# Altium schematic sheet Fuente.SchDoc: Fuente_SCH
size A4; Author: Hojnadel - Salazar Ato; Revision: Rev1.0; SheetNumber: 2; SheetTotal: 6
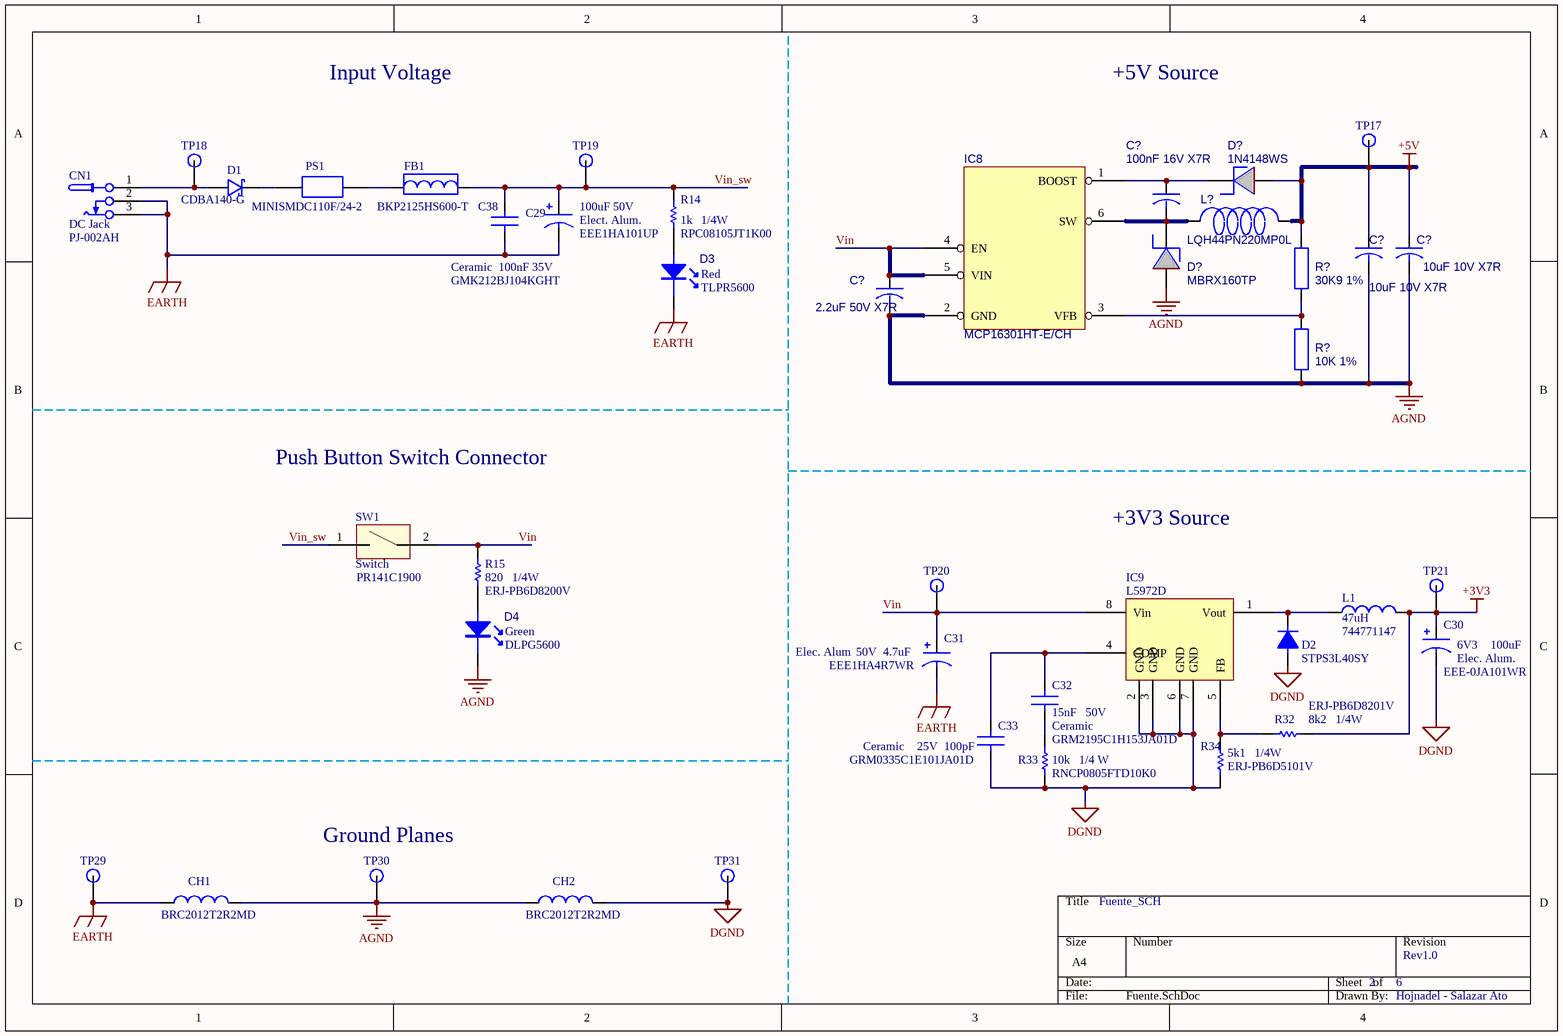
[diagram p0: Fuente.SchDoc]

## Parts
(Parts that share a designator on the sheet are numbered #1, #2 ... from top to bottom, then left to right.)
C29  C: 100uF  V: 50V  Material: Elect. Alum.  Part number: EEE1HA101UP  [C_AE10083X105M]  (hidden comment: 100uF 50V ElecAlum)
C30  C: 100uF  V: 6V3  Material: Elec. Alum.  Part number: EEE-0JA101WR  [C_AE6553X54M]  (hidden comment: 100uF 6V3 ElecAlum)
C31  C: 4.7uF  V: 50V  Material: Elec. Alum  Part number: EEE1HA4R7WR  [C_AE6553X54M]  (hidden comment: 4.7uF 50V ElecAlum)
C32  C: 15nF  V: 50V  Part Number: GRM2195C1H153JA01D  Material: Ceramic  [C_0805]  (hidden comment: 15nF 50V Ceramic)
C33  C: 100pF  V: 25V  Part Number: GRM0335C1E101JA01D  Material: Ceramic  [C_0805]  (hidden comment: 100pF 25V Ceramic)
C38  C: 100nF  V: 35V  Part Number: GMK212BJ104KGHT  Material: Ceramic  [C_0805]  (hidden comment: 100nF 35V Ceramic)
C?#1  100nF 16V X7R  [C_0805]
C?#2  10uF 10V X7R  [C_0805]
C?#3  10uF 10V X7R  [C_0805]
C?#4  2.2uF 50V X7R  [C_0805]
CH1  Part Number: BRC2012T2R2MD  [I_CHOQUE_DFN]  (hidden comment: Choke)
CH2  Part Number: BRC2012T2R2MD  [I_CHOQUE_DFN]  (hidden comment: Choke)
CN1  DC Jack  Part Number: PJ-002AH  [Jack_PJ002A]
D1  CDBA140-G  [D_DO-214AC_Schottky]
D2  Part Number: STPS3L40SY  [D_M6959X25N]  (hidden comment: STPS3L40)
D3  Color: Red  Part Number: TLPR5600  [Led_TH]  (hidden comment: LED)
D4  Part Number: DLPG5600  Color: Green  [Led_TH]  (hidden comment: LED)
D?#1  1N4148WS  [SOD_323]
D?#2  MBRX160TP  [SOD_123]
FB1  Part Number: BKP2125HS600-T  [Ferrite_bead]  (hidden comment: Ferrite Bead)
IC8  MCP16301HT-E/CH  [SOT23_6P]
IC9  L5972D  [SO8]
L1  Part Number: 744771147  [I_P128122X60N]  (hidden comment: 47uH)
L?  LQH44PN220MP0L  [VLCF5028]
PS1  Part Number: MINISMDC110F/24-2  [POLISWITCH_1]  (hidden comment: Polyswitch)
R14  value 1k  Potencia: 1/4W  Part Number: RPC08105JT1K00  [R_0805]  (hidden comment: Res1)
R15  value 820  Potencia: 1/4W  Part Number: ERJ-PB6D8200V  [R_0805]  (hidden comment: Res1)
R32  value 8k2  Part Number: ERJ-PB6D8201V  Power: 1/4W  [R_0805]  (hidden comment: 8k2 1/4W)
R33  value 10k  Part Number: RNCP0805FTD10K0  Power: 1/4 W  [R_0805]  (hidden comment: 10k 1/4W)
R34  value 5k1  Part Number: ERJ-PB6D5101V  Power: 1/4W  [R_0805]  (hidden comment: 5k1 1/4W)
R?#1  30K9 1%  [R_0805]
R?#2  10K 1%  [R_0805]
SW1  Switch  Part Number: PR141C1900  [BORNERA_2X5MM]
TP17  TP  [TP]  (value not drawn)
TP18  TP  [TP]  (value not drawn)
TP19  TP  [TP]  (value not drawn)
TP20  TP  [TP]  (value not drawn)
TP21  TP  [TP]  (value not drawn)
TP29  TP  [TP]  (value not drawn)
TP30  TP  [TP]  (value not drawn)
TP31  TP  [TP]  (value not drawn)

## Nets
+3V3: C30.1 L1.2 R32.1 TP21.1
+5V: C?#2.1 C?#3.1 D?#1.1(A) L?.2 R?#1.2 TP17.1
AGND: C?#2.2 C?#3.2 C?#4.2 CH1.2 CH2.1 D4.2 D?#2.1(A) IC8.2(GND) R?#2.1 TP30.1
DGND: C30.2 C33.2 CH2.2 D2.1 IC9.2(GND) IC9.3(GND) IC9.6(GND) IC9.7(GND) R33.1 R34.1 TP31.1
EARTH: C29.2 C31.2 C38.2 CH1.1 CN1.2 CN1.3 D3.2 TP29.1
Vin: C31.1 C?#4.1 IC8.4(EN) IC8.5(VIN) IC9.8(Vin) R15.2 SW1.2 TP20.1
Vin_sw: C29.1 C38.1 FB1.2 R14.1 SW1.1 TP19.1
NetC32_1: C32.1 C33.1 IC9.4(COMP)
NetC32_2: C32.2 R33.2
NetC?#1_1: C?#1.1 D?#1.2(K) IC8.1(BOOST)
NetC?#1_2: C?#1.2 D?#2.2(K) IC8.6(SW) L?.1
NetCN1_1: CN1.1 D1.1(A) TP18.1
NetD1_2: D1.2(K) PS1.1
NetD2_2: D2.2 IC9.1(Vout) L1.1
NetD3_1: D3.1 R14.2
NetD4_1: D4.1 R15.1
NetFB1_1: FB1.1 PS1.2
NetIC8_3: IC8.3(VFB) R?#1.1 R?#2.2
NetIC9_5: IC9.5(FB) R32.2 R34.2

## Notes on the sheet
- Input Voltage
- +5V Source
- Push Button Switch Connector
- +3V3 Source
- (near TP30) Ground Planes

## Library data of the parts
C29-C31 = Cap_Elec: Capacitor
C32 C33 C38 = Cap1: Capacitor
C?#1-C?#4 = CAP: Capacitor
CN1 = Barrel_jack: Connector
D1 = Diodo_Schottky: Diodo Schottky; Part Number: CDBA140-G
D2 = DIODO: Diode
D?#1 = DIODO_SH: Diode Shottky
D?#2 = DIODO_SH: Diode schottky
IC8 = MCP16301: Buck 36V-adj 600mA SOT-6
IC9 = L5972D: Fuente Switching; Part Number: L5972D013TR
L1 = Inductor: Code_IEC: 1005; Published: 8-Jun-2000; LatestRevisionDate: 29-May-2009; LatestRevisionNote: IPC-7351 Footprint Added.; PackageReference: 0402-A; Publisher: Altium Limited; PackageDescription: Chip Inductor; Code_JEITA: 0402; Value: 47uH
L? = Inductor
PS1 = Poliswitch: Polishwitch
R14 R32-R34 = Res1: Resistor
R15 = Res1: Resistor; Tolerance: 5%
R?#1 R?#2 = RES: Resistor
SW1 = SW
TP17-TP21 TP29-TP31 = Test Point